# Altium schematic sheet [02]BLOCK DIAGRAM.SchDoc
size A3; CheckedBy: R. LIPAR; Author: R. LIPAR; CompanyName: Pelinci; DrawnBy: R. LIPAR; Engineer: R. LIPAR; Organization: Pelinci; Address2: SI-4208 Sencur; Address3: Slovenia

## Notes on the sheet
- Variant:
- Title:
- SCH Revision:
- SCH Name:
- SCH date:
- Date:
- Code:
- Sheet:
- of
- Size:
- A3
- DrawnBy:
- CheckedBy:
- Document name:
- Revision:
- Any illegal copying and transfer of this document to third party is strictly forbidden